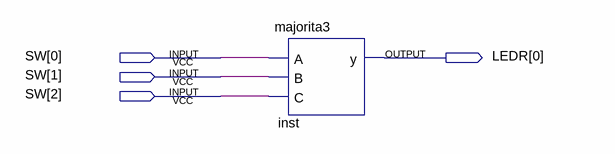
[diagram p0: schematic sheet]
// Quartus schematic test.bdf as structural Verilog: 1 symbols, 4 pins
module test (
  input  [2:0] SW,
  output [0:0] LEDR
);

  majorita3 inst (.A(SW[0]), .B(SW[1]), .C(SW[2]), .y(LEDR[0]));
endmodule
